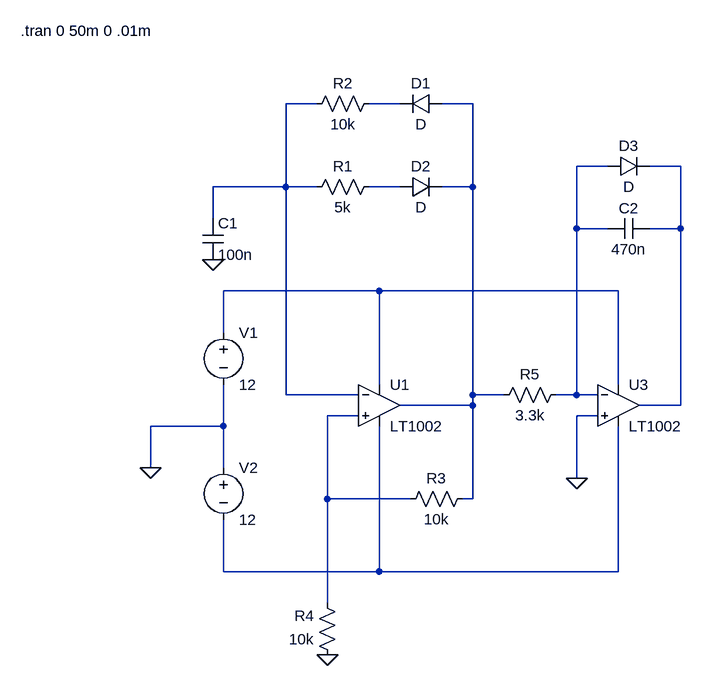
[diagram p0: schematic cuadrada2.asc]
cuadrada2.asc, the LTspice schematic file:
Version 4
SHEET 1 888 680
WIRE 64 -272 16 -272
WIRE 192 -272 144 -272
WIRE 304 -272 256 -272
WIRE 512 -176 464 -176
WIRE 624 -176 576 -176
WIRE 16 -144 16 -272
WIRE 16 -144 -96 -144
WIRE 64 -144 16 -144
WIRE 192 -144 144 -144
WIRE 304 -144 304 -272
WIRE 304 -144 256 -144
WIRE -96 -96 -96 -144
WIRE 464 -80 464 -176
WIRE 512 -80 464 -80
WIRE 624 -80 624 -176
WIRE 624 -80 576 -80
WIRE 160 16 -80 16
WIRE 528 16 160 16
WIRE -80 80 -80 16
WIRE 160 160 160 16
WIRE 528 160 528 16
WIRE 16 176 16 -144
WIRE 128 176 16 176
WIRE 304 176 304 -144
WIRE 352 176 304 176
WIRE 464 176 464 -80
WIRE 464 176 432 176
WIRE 496 176 464 176
WIRE 304 192 304 176
WIRE 304 192 192 192
WIRE 624 192 624 -80
WIRE 624 192 560 192
WIRE 128 208 80 208
WIRE 496 208 464 208
WIRE -80 224 -80 160
WIRE -80 224 -192 224
WIRE -192 288 -192 224
WIRE -80 288 -80 224
WIRE 464 304 464 208
WIRE 80 336 80 208
WIRE 208 336 80 336
WIRE 304 336 304 192
WIRE 304 336 288 336
WIRE -80 448 -80 368
WIRE 160 448 160 224
WIRE 160 448 -80 448
WIRE 528 448 528 224
WIRE 528 448 160 448
WIRE 80 496 80 336
FLAG -192 288 0
FLAG -96 -32 0
FLAG 80 576 0
FLAG 464 304 0
SYMBOL voltage -80 64 R0
WINDOW 123 0 0 Left 2
WINDOW 39 0 0 Left 2
SYMATTR InstName V1
SYMATTR Value 12
SYMBOL voltage -80 272 R0
WINDOW 123 0 0 Left 2
WINDOW 39 0 0 Left 2
SYMATTR InstName V2
SYMATTR Value 12
SYMBOL res 160 -160 R90
WINDOW 0 0 56 VBottom 2
WINDOW 3 32 56 VTop 2
SYMATTR InstName R1
SYMATTR Value 5k
SYMBOL res 160 -288 R90
WINDOW 0 0 56 VBottom 2
WINDOW 3 32 56 VTop 2
SYMATTR InstName R2
SYMATTR Value 10k
SYMBOL diode 256 -288 R90
WINDOW 0 0 32 VBottom 2
WINDOW 3 32 32 VTop 2
SYMATTR InstName D1
SYMBOL diode 192 -128 R270
WINDOW 0 32 32 VTop 2
WINDOW 3 0 32 VBottom 2
SYMATTR InstName D2
SYMBOL cap -112 -96 R0
SYMATTR InstName C1
SYMATTR Value 100n
SYMBOL res 304 320 R90
WINDOW 0 0 56 VBottom 2
WINDOW 3 32 56 VTop 2
SYMATTR InstName R3
SYMATTR Value 10k
SYMBOL res 96 592 R180
WINDOW 0 36 76 Left 2
WINDOW 3 36 40 Left 2
SYMATTR InstName R4
SYMATTR Value 10k
SYMBOL res 448 160 R90
WINDOW 0 0 56 VBottom 2
WINDOW 3 32 56 VTop 2
SYMATTR InstName R5
SYMATTR Value 3.3k
SYMBOL cap 576 -96 R90
WINDOW 0 0 32 VBottom 2
WINDOW 3 32 32 VTop 2
SYMATTR InstName C2
SYMATTR Value 470n
SYMBOL diode 512 -160 R270
WINDOW 0 32 32 VTop 2
WINDOW 3 0 32 VBottom 2
SYMATTR InstName D3
SYMBOL Opamps\\LT1002 528 128 R0
SYMATTR InstName U3
SYMBOL Opamps\\LT1002 160 128 R0
SYMATTR InstName U1
TEXT -392 -384 Left 2 !.tran 0 50m 0 .01m

The netlist it stands for:
* cuadrada2.asc
V1 N007 0 12
V2 0 N009 12
R1 N006 N001 5k
R2 N002 N001 10k
D1 N003 N002 D
D2 N006 N003 D
C1 N001 0 100n
R3 N003 N008 10k
R4 0 N008 10k
R5 N004 N003 3.3k
C2 N005 N004 470n
D3 N004 N005 D
XU3 0 N004 N007 N009 N005 LT1002  ; pins In+ In- V+ V- OUT
XU1 N008 N001 N007 N009 N003 LT1002  ; pins In+ In- V+ V- OUT
.model D D
.lib standard.dio
.tran 0 50m 0 .01m
.backanno
.end